# Altium schematic sheet Sheet1.SchDoc
size A4
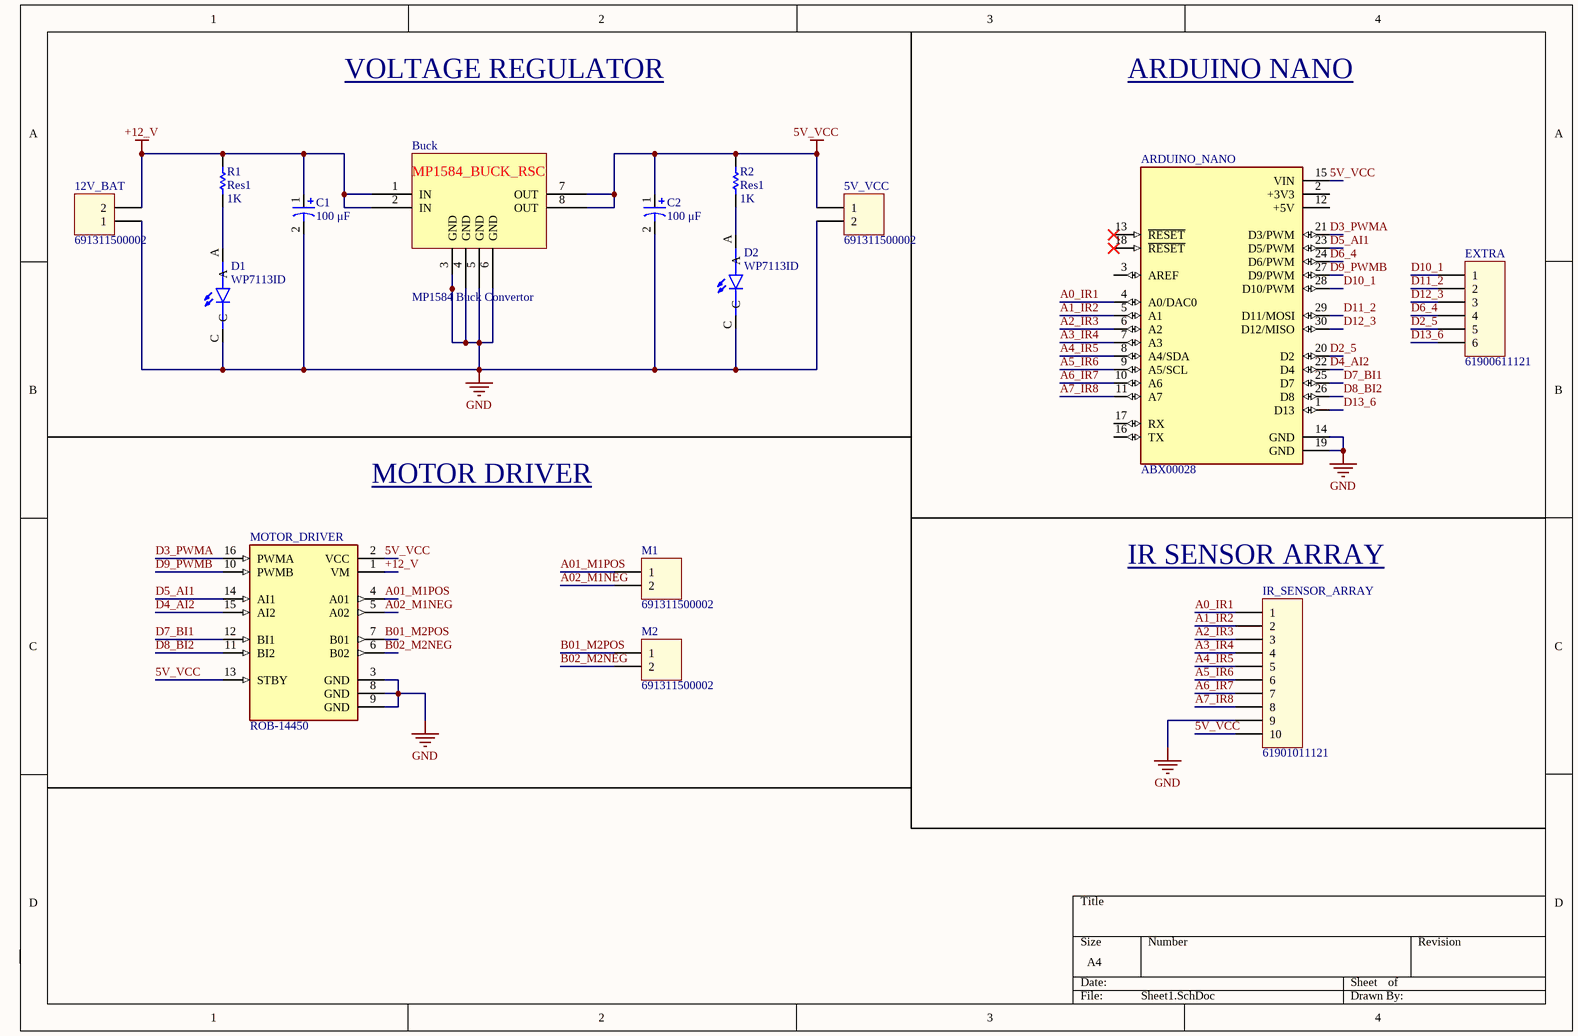
[diagram p0: Sheet1.SchDoc]

## Parts
5V_VCC  691311500002  [691311500002]
12V_BAT  691311500002  [691311500002]
ARDUINO_NANO  ABX00028  [MODULE_ABX00028]
Buck  MP1584 Buck Convertor  [MP1584]
C1  100 μF  [WCAP-AT1H 5x11x2x0.5]
C2  100 μF  [WCAP-AT1H 5x11x2x0.5]
D1  WP7113ID  [LED_WP7113ID]
D2  WP7113ID  [LED_WP7113ID]
EXTRA  61900611121  [61900611121]
IR_SENSOR_ARRAY  61901011121  [61901011121]
M1  691311500002  [691311500002]
M2  691311500002  [691311500002]
MOTOR_DRIVER  ROB-14450  [MODULE_ROB-14450]
R1  Res1  value 1K  [AXIAL-0.3]
R2  Res1  value 1K  [AXIAL-0.3]

## Nets
5V_VCC: 5V_VCC.1 ARDUINO_NANO.15(VIN) Buck.7(OUT) Buck.8(OUT) C2.1 IR_SENSOR_ARRAY.10 MOTOR_DRIVER.2(VCC) MOTOR_DRIVER.13(STBY) R2.2
+12_V: 12V_BAT.2 Buck.1(IN) Buck.2(IN) C1.1 MOTOR_DRIVER.1(VM) R1.2
GND: 5V_VCC.2 12V_BAT.1 ARDUINO_NANO.14(GND) ARDUINO_NANO.19(GND) Buck.3(GND) Buck.4(GND) Buck.5(GND) Buck.6(GND) C1.2 C2.2 D1.C D2.C IR_SENSOR_ARRAY.9 MOTOR_DRIVER.3(GND) MOTOR_DRIVER.8(GND) MOTOR_DRIVER.9(GND)
A0_IR1: ARDUINO_NANO.4(A0/DAC0) IR_SENSOR_ARRAY.1
A1_IR2: ARDUINO_NANO.5(A1) IR_SENSOR_ARRAY.2
A01_M1POS: M1.1 MOTOR_DRIVER.4(A01)
A2_IR3: ARDUINO_NANO.6(A2) IR_SENSOR_ARRAY.3
A02_M1NEG: M1.2 MOTOR_DRIVER.5(A02)
A3_IR4: ARDUINO_NANO.7(A3) IR_SENSOR_ARRAY.4
A4_IR5: ARDUINO_NANO.8(A4/SDA) IR_SENSOR_ARRAY.5
A5_IR6: ARDUINO_NANO.9(A5/SCL) IR_SENSOR_ARRAY.6
A6_IR7: ARDUINO_NANO.10(A6) IR_SENSOR_ARRAY.7
A7_IR8: ARDUINO_NANO.11(A7) IR_SENSOR_ARRAY.8
B01_M2POS: M2.1 MOTOR_DRIVER.7(B01)
B02_M2NEG: M2.2 MOTOR_DRIVER.6(B02)
D2_5: ARDUINO_NANO.20(D2) EXTRA.5
D3_PWMA: ARDUINO_NANO.21(D3/PWM) MOTOR_DRIVER.16(PWMA)
D4_AI2: ARDUINO_NANO.22(D4) MOTOR_DRIVER.15(AI2)
D5_AI1: ARDUINO_NANO.23(D5/PWM) MOTOR_DRIVER.14(AI1)
D6_4: ARDUINO_NANO.24(D6/PWM) EXTRA.4
D7_BI1: ARDUINO_NANO.25(D7) MOTOR_DRIVER.12(BI1)
D8_BI2: ARDUINO_NANO.26(D8) MOTOR_DRIVER.11(BI2)
D9_PWMB: ARDUINO_NANO.27(D9/PWM) MOTOR_DRIVER.10(PWMB)
D10_1: ARDUINO_NANO.28(D10/PWM) EXTRA.1
D11_2: ARDUINO_NANO.29(D11/MOSI) EXTRA.2
D12_3: ARDUINO_NANO.30(D12/MISO) EXTRA.3
D13_6: ARDUINO_NANO.1(D13) EXTRA.6
NetD1_A: D1.A R1.1
NetD2_A: D2.A R2.1

Not connected (* = marked no-connect by the designer): ARDUINO_NANO 2(+3V3) 3(AREF) 12(+5V) 13(~{RESET})* 16(TX) 17(RX) 18(~{RESET})*

## Notes on the sheet
- VOLTAGE REGULATOR
- ARDUINO NANO
- MOTOR DRIVER
- (near IR_SENSOR_ARRAY) IR SENSOR ARRAY
- (in symbol MP1584 Buck Convertor) MP1584_BUCK_RSC

## Library data of the parts
5V_VCC 12V_BAT M1 M2 = 691311500002: WR-TBL Serie 311 - 5.08 mm Open Vertical PCB Header, 02p; Pitch: 5.08 mm; ComponentLink1Description: Manufacturer; ComponentLink1URL: http://www.we-online.de; ComponentLink2Description: Datasheet; ComponentLink2URL: http://katalog.we-online.de/em/datasheet/6913115000xx.pdf; Part Number: 691311500002; Published Date: Feb. 2017; Publisher: Wurth Elektronik; Pin Number: 02p
ARDUINO_NANO = ABX00028: Arduinoâ€™s 5V compatible board in the smallest available form factor: 45x18mm!; MP: Arduino Nano Every; Check_prices: https://www.snapeda.com/parts/Arduino%20Nano%20Every/Arduino/view-part/?ref=eda; Value: *; Availability: Not in stock; Price: None; Package: None; SnapEDA_Link: https://www.snapeda.com/parts/Arduino%20Nano%20Every/Arduino/view-part/?ref=snap; MF: Arduino
C1 C2 = WCAP-AT1H 5x11x2x0.5 860240472002: WCAP-AT1H Aluminum Electrolytic Capacitors , 33 μF; + / - 20%; 25 V , 5 x 11; Manufacturer: Wurth Elektronik; E-mail: libraries@we-online.com; Characteristics: Aluminum Electrolytic Capacitor; Recommended soldering: Wave; Operating temperature:–40 °C to +105 °C for UR < 400 V; –25 °C to +105 °C for UR ≥ 400 V; Long life product series; Higher permissible ripple current; Load life: 5000–10000 h @ +105 °C; ComponentLink1Description: Manufacturer; ComponentLink1URL: http://www.we-online.com; ComponentLink2Description: Datasheet; ComponentLink2URL: http://katalog.we-online.de/pbs/datasheet/860240472002.pdf; Created by: Karrer Zheng; Created Date: 6/8/2015; Capacitance: 100 μF; Application: Medium and high voltage type range from 160V-450V used as primary side input filter in power supply; Low voltage type used as energy storage or low frequency filtering in circuit, applied to general switching power supply, AC-DC converter, adapter, charger, TV, VCR, DC motor circuit filter, digital audio, digital cameras, digital video cameras, satellite receiver etc.; partNo: 860240472002
D1 D2 = WP7113ID: Red 617nm LED Indication - Discrete 2V Radial; MF: Kingbright; Price: None; MP: WP7113ID; Package: Radial Kingbright; Check_prices: https://www.snapeda.com/parts/WP7113ID/Kingbright/view-part/?ref=eda; Purchase-URL: https://pricing.snapeda.com/search/part/WP7113ID/?ref=eda; Availability: In Stock; Value: *; SnapEDA_Link: https://www.snapeda.com/parts/WP7113ID/Kingbright/view-part/?ref=snap
EXTRA = 61900611121: WR-WTB 2.54mm Male Locking Header, 6p; Pin Number: 6; ComponentLink1Description: Manufacturer; ComponentLink1URL: http://www.we-online.de; ComponentLink2Description: Datasheet; ComponentLink2URL: http://katalog.we-online.de/em/datasheet/6190xx11121.pdf; Part Number: 61900611121; Published Date: June 2017; Publisher: Wurth Elektronik; Pitch: 2.54 mm
IR_SENSOR_ARRAY = 61901011121: WR-WTB 2.54mm Male Locking Header, 10p; Pin Number: 10; ComponentLink1Description: Manufacturer; ComponentLink1URL: http://www.we-online.de; ComponentLink2Description: Datasheet; ComponentLink2URL: http://katalog.we-online.de/em/datasheet/6190xx11121.pdf; Part Number: 61901011121; Published Date: June 2017; Publisher: Wurth Elektronik; Pitch: 2.54 mm
MOTOR_DRIVER = ROB-14450: TB6612FNG Motor Controller/Driver Power Management Evaluation Board; MF: SparkFun Electronics; Check_prices: https://www.snapeda.com/parts/ROB-14450/SparkFun%20Electronics/view-part/2656367/?ref=eda; Package: None; MP: ROB-14450; Value: *; Availability: In Stock; SnapEDA_Link: https://www.snapeda.com/parts/ROB-14450/SparkFun%20Electronics/view-part/2656367/?ref=snap; Price: None
R1 R2 = Res1: Resistor; Published: 8-Jun-2000; LatestRevisionDate: 17-Jul-2002; LatestRevisionNote: Re-released for DXP Platform.; PackageReference: AXIAL-0.3; Publisher: Altium Limited; PackageDescription: Axial Device, Thru-Hole; 2 Leads; 0.3 in Pin Spacing